# Altium schematic sheet 03. Power.SchDoc
size A4; CheckedBy: 黄钦宁; Author: 陈坤; DocumentNumber: 3; SheetNumber: 3; SheetTotal: 13; PageSetup: Record=PageOptions|CenterHorizontal=True|CenterVertical=True|PrintScale=1.00|XCorrection=1.00|YCorrection=1.00|PrintKind=0|BorderSize=5000000|LeftOffset=0|BottomOffset=0|Orientation=2|PaperLength=1000|PaperWidth=1000|Scale=100|PaperSource=7|PrintQuality=600|MediaType=1|DitherType=10|PaperKind=A4|PrintScaleMode=1; DesignDate: 2013-08-16; CheckDate: 2013-12-28; SheetName: Power; SheetVersion: V1.00; SheetDescription: 评估板电源，包括1路5V，1路3.3V; ProductModel: EasyARM-iMX283; ProductName: EasyARM-iMX28学习套件
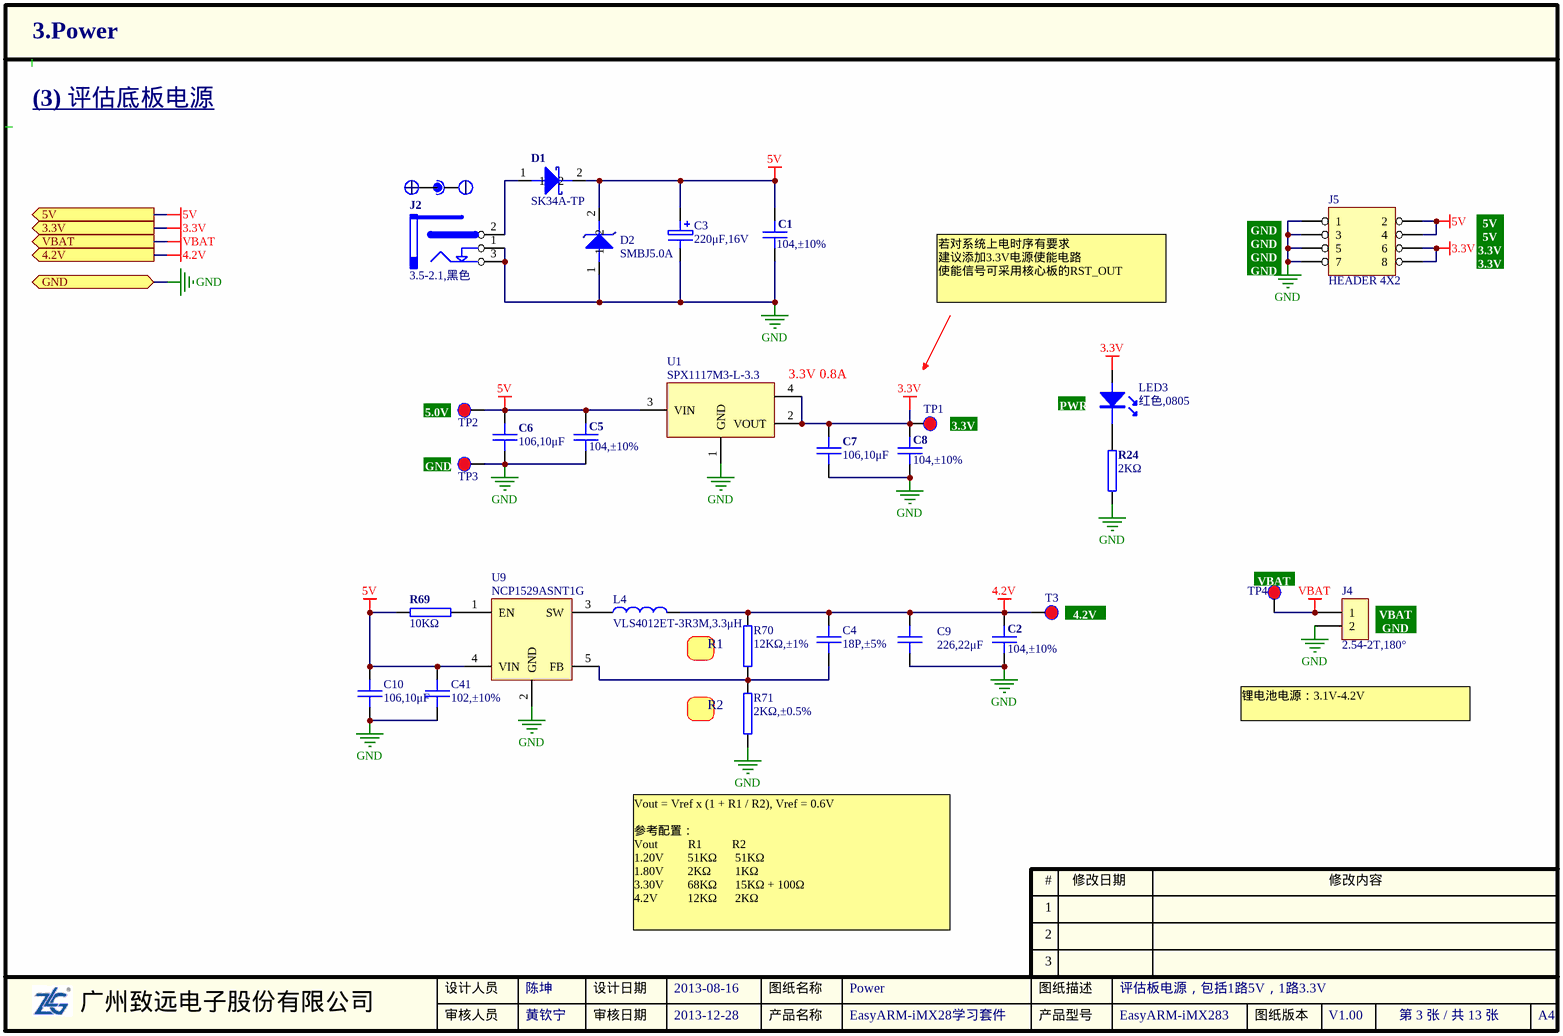
[diagram p0: 03. Power.SchDoc]

## Parts
C1  104,±10%  [0603C]
C2  104,±10%  [0603C]
C3  220μF,16V  [RB-.1/.25]
C4  18P,±5%  [0603C]
C5  104,±10%  [0603C]
C6  106,10μF  [0805C]
C7  106,10μF  [0805C]
C8  104,±10%  [0603C]
C9  226,22μF  [0805C]
C10  106,10μF  [0805C]
C41  102,±10%  [0603C]
D1  value SK34A-TP  [SOD-SK34A]  (hidden comment: DIODE SCHOTTKY)
D2  value SMBJ5.0A  [1812D]  (hidden comment: DIODE ZENER)
J2  value 3.5-2.1,黑色  [POWER-AC]  (hidden comment: POWER-COM)
J4  value 2.54-2T,180°  [CN-2-2.54]  (hidden comment: CON2)
J5  HEADER 4X2  [IDC-8]
L4  value VLS4012ET-3R3M,3.3μH  [L-4.0S-VLS]  (hidden comment: INDUCTOR1)
LED3  value 红色,0805  [LED-0805]  (hidden comment: LED1)
R24  2KΩ  [0603R]
R69  10KΩ  [0603R]
R70  12KΩ,±1%  [0603R]
R71  2KΩ,±0.5%  [0603R]
T3  4.2V  [PAD-40]  (value not drawn)
TP1  3.3V  [PAD-40]  (value not drawn)
TP2  5.0V  [PAD-40]  (value not drawn)
TP3  GND  [PAD-40]  (value not drawn)
TP4  VBAT  [PAD-40]  (value not drawn)
U1  value SPX1117M3-L-3.3  [SOT-223]  (hidden comment: SPX1117M3-L/TR)
U9  value NCP1529ASNT1G  [SOT-23-5]  (hidden comment: SCY99090SNT1G)

## Ports
3.3V, 4.2V (out), 5V (out), GND, VBAT (out)

## Nets
3.3V: C7.1 C8.1 J5.6 J5.8 LED3.1 TP1.1 U1.2(VOUT) U1.4 ; port 3.3V
4.2V: C2.1 C4.1 C9.1 L4.2 R70.2 T3.1 ; port 4.2V
5V: C1.1 C3.1 C5.1 C6.1 C10.1 C41.1 D1.2 D2.2 J5.2 J5.4 R69.1 TP2.1 U1.3(VIN) U9.4(VIN) ; port 5V
GND: C1.2 C2.2 C3.2 C5.2 C6.2 C7.2 C8.2 C9.2 C10.2 C41.2 D2.1 J2.1(A) J2.3(B) J4.2 J5.1 J5.3 J5.5 J5.7 R24.1 R71.1 TP3.1 U1.1(GND) U9.2(GND) ; port GND
VBAT: J4.1 TP4.1 ; port VBAT
NetC4_2: C4.2 R70.1 R71.2 U9.5(FB)
NetD1_1: D1.1 J2.2(B)
NetL4_1: L4.1 U9.3(SW)
NetLED3_2: LED3.2 R24.2
NetR69_2: R69.2 U9.1(EN)

## Notes on the sheet
- (3) 评估底板电源
- (near J5) GND
- 5V
- 3.3V
- 若对系统上电时序有要求
  建议添加3.3V电源使能电路
  使能信号可采用核心板的RST_OUT
- (near U1) 3.3V 0.8A
- (near TP2) 5.0V
- (near LED3) PWR
- (near TP3) GND
- (near TP4) VBAT
- R1
- (near T3) 4.2V
- (near J4) VBAT
- (near J4) GND
- R2
- 锂电池电源：3.1V-4.2V
- Vout = Vref x (1 + R1 / R2), Vref = 0.6V
  参考配置：
  Vout          R1          R2
  1.20V        51KΩ      51KΩ
  1.80V        2KΩ        1KΩ
  3.30V        68KΩ      15KΩ + 100Ω
  4.2V          12KΩ      2KΩ
- 1
- #
- 修改日期
- 修改内容
- 2
- 3
- 广州致远电子股份有限公司
- 设计人员
- 审核人员
- 设计日期
- 审核日期
- 产品名称
- 图纸名称
- 产品型号
- 图纸描述
- 图纸版本
- A4

## Library data of the parts
C1 C2 C5 C8 = 1.02.01.0032: 104,±10%,50V,X7R,0603,*,RoHS; 名称: 电容; 封装: 0603; 设备封装名称: C0603_104_X7R_50V_10%; 贴片和直插: SMT; 器件优选方案: 优先选用; 物料代码: 1.02.01.0032; Value: 104,±10%; RoHS: RoHS; 型号: 104,±10%,50V,X7R; ComponentLink1Description: ErpDataInfo; ComponentLink1URL: http://erp.zlgmcu.com/ErpExt/ErpData/ListMateriel.aspx?pkey=1.02.01.0032
C3 = 1.02.11.0018: 220μF,16V,Ф6.3×7mm,,珠海华冠,RoHS; 名称: 电解电容; 贴片和直插: THT; 物料代码: 1.02.11.0018; Value: 220μF,16V; 厂商: 珠海华冠; RoHS: RoHS; 型号: 220μF,16V,Ф6.3×7mm; ComponentLink1Description: ErpDataInfo; ComponentLink1URL: http://erp.zlgmcu.com/ErpExt/ErpData/ListMateriel.aspx?pkey=1.02.11.0018
C4 = 1.02.01.0003: 18P,±5%,50V,COG,0603,*,RoHS; 名称: 电容; 封装: 0603; 设备封装名称: C0603_18P_COG_50V_5%; 贴片和直插: SMT; 物料代码: 1.02.01.0003; Value: 18P,±5%; RoHS: RoHS; 型号: 18P,±5%,50V,COG; ComponentLink1Description: ErpDataInfo; ComponentLink1URL: http://erp.zlgmcu.com/ErpExt/ErpData/ListMateriel.aspx?pkey=1.02.01.0003
C6 C7 C10 = 1.02.02.0055: 106,10μF,±10%,10V,X5R,0805,RoHS; 名称: 电容; 封装: 0805; 设备封装名称: C0805_106_X5R_10V_10%; 贴片和直插: SMT; 物料代码: 1.02.02.0055; Value: 106,10μF; RoHS: RoHS; 型号: 106,10μF,±10%,10V,X5R; ComponentLink1Description: ErpDataInfo; ComponentLink1URL: http://erp.zlgmcu.com/ErpExt/ErpData/ListMateriel.aspx?pkey=1.02.02.0055
C9 = 1.02.02.0059: 226,22μF,±20%,6.3V,X5R,0805,RoHS; 名称: 电容; 封装: 0805; 设备封装名称: C0805_226_X5R_6.3V_20%; 贴片和直插: SMT; 物料代码: 1.02.02.0059; Value: 226,22μF; RoHS: RoHS; 型号: 226,22μF,±20%,6.3V,X5R; ComponentLink1Description: ErpDataInfo; ComponentLink1URL: http://erp.zlgmcu.com/ErpExt/ErpData/ListMateriel.aspx?pkey=1.02.02.0059
C41 = 1.02.01.0020: 102,±10%,50V,X7R,0603,*,RoHS; 名称: 电容; 封装: 0603; 设备封装名称: C0603_102_X7R_50V_10%; 贴片和直插: SMT; 物料代码: 1.02.01.0020; Value: 102,±10%; RoHS: RoHS; 型号: 102,±10%,50V,X7R; ComponentLink1Description: ErpDataInfo; ComponentLink1URL: http://erp.zlgmcu.com/ErpExt/ErpData/ListMateriel.aspx?pkey=1.02.01.0020
D1 = 1.04.07.0021: SK34A-TP,DO-214AC,MCC,RoHS; 名称: 二极管; 设备封装名称: DO-214AC_SK34A; 贴片和直插: SMT; 物料代码: 1.04.07.0021; 封装: DO-214AC; 厂商: MCC; RoHS: RoHS; 型号: SK34A-TP; ComponentLink1Description: ErpDataInfo; ComponentLink1URL: http://erp.zlgmcu.com/ErpExt/ErpData/ListMateriel.aspx?pkey=1.04.07.0021
D2 = 1.04.03.0001: SMBJ5.0A,DO-214AA,君耀,RoHS; 名称: TVS管; 设备封装名称: DO-214AA_SMBJ5.0A; 贴片和直插: SMT; 器件优选方案: 优先选用; 物料代码: 1.04.03.0001; 封装: DO-214AA; 厂商: 君耀; RoHS: RoHS; 型号: SMBJ5.0A; ComponentLink1Description: ErpDataInfo; ComponentLink1URL: http://erp.zlgmcu.com/ErpExt/ErpData/ListMateriel.aspx?pkey=1.04.03.0001
J2 = 1.10.05.0001: 3.5-2.1,黑色,RoHS; 名称: 电源座; 贴片和直插: THT; 物料代码: 1.10.05.0001; RoHS: RoHS; 型号: 3.5-2.1,黑色; ComponentLink1Description: ErpDataInfo; ComponentLink1URL: http://erp.zlgmcu.com/ErpExt/ErpData/ListMateriel.aspx?pkey=1.10.05.0001
J4 = 1.10.06.0009: 2.54-2T,180°,,*; 名称: 插座; 贴片和直插: THT; 物料代码: 1.10.06.0009; 型号: 2.54-2T,180°; ComponentLink1Description: ErpDataInfo; ComponentLink1URL: http://erp.zlgmcu.com/ErpExt/ErpData/ListMateriel.aspx?pkey=1.10.06.0009
L4 = 1.03.01.0155: VLS4012ET-3R3M,3.3μH,1.4A,SMD,TDK,RoHS; 名称: 电感; 贴片和直插: SMT; 物料代码: 1.03.01.0155; 封装: SMD; 厂商: TDK; RoHS: RoHS; 型号: VLS4012ET-3R3M,3.3μH,1.4A; ComponentLink1Description: ErpDataInfo; ComponentLink1URL: http://erp.zlgmcu.com/ErpExt/ErpData/ListMateriel.aspx?pkey=1.03.01.0155
LED3 = 1.04.05.0001: 红色,0805,0805,RoHS; 名称: 发光二极管; 封装: 0805; 设备封装名称: LED0805-RED; 贴片和直插: SMT; 器件优选方案: 优先选用; 物料代码: 1.04.05.0001; RoHS: RoHS; 型号: 红色,0805; ComponentLink1Description: ErpDataInfo; ComponentLink1URL: http://erp.zlgmcu.com/ErpExt/ErpData/ListMateriel.aspx?pkey=1.04.05.0001
R24 = 1.01.01.0038: 2KΩ,0603,*,RoHS; 名称: 电阻; 封装: 0603; 设备封装名称: R0603_2K; 贴片和直插: SMT; 物料代码: 1.01.01.0038; Value: 2KΩ; RoHS: RoHS; 型号: 2KΩ; ComponentLink1Description: ErpDataInfo; ComponentLink1URL: http://erp.zlgmcu.com/ErpExt/ErpData/ListMateriel.aspx?pkey=1.01.01.0038
R69 = 1.01.01.0051: 10KΩ,0603,*,RoHS; 名称: 电阻; 封装: 0603; 设备封装名称: R0603_10K; 贴片和直插: SMT; 物料代码: 1.01.01.0051; Value: 10KΩ; RoHS: RoHS; 型号: 10KΩ; ComponentLink1Description: ErpDataInfo; ComponentLink1URL: http://erp.zlgmcu.com/ErpExt/ErpData/ListMateriel.aspx?pkey=1.01.01.0051
R70 = 1.01.01.0053: 12KΩ,±1%,0603,*,RoHS; 名称: 电阻; 封装: 0603; 设备封装名称: R0603_12K_1%; 贴片和直插: SMT; 物料代码: 1.01.01.0053; Value: 12KΩ,±1%; RoHS: RoHS; 型号: 12KΩ,±1%; ComponentLink1Description: ErpDataInfo; ComponentLink1URL: http://erp.zlgmcu.com/ErpExt/ErpData/ListMateriel.aspx?pkey=1.01.01.0053
R71 = 1.01.01.0084: 2KΩ,±0.5%,0603,*,RoHS; 名称: 电阻; 封装: 0603; 设备封装名称: R0603_2K_0.5%; 贴片和直插: SMT; 物料代码: 1.01.01.0084; Value: 2KΩ,±0.5%; RoHS: RoHS; 型号: 2KΩ,±0.5%; ComponentLink1Description: ErpDataInfo; ComponentLink1URL: http://erp.zlgmcu.com/ErpExt/ErpData/ListMateriel.aspx?pkey=1.01.01.0084
T3 TP1-TP4 = TEST-DOT
U1 = 1.05.09.0025: SPX1117M3-L-3.3,SOT-223,EXAR,RoHS; 名称: IC; 设备封装名称: SOT-223_SPX1117M3-L-3.3; 贴片和直插: SMT; 物料代码: 1.05.09.0025; 封装: SOT-223; 厂商: EXAR; RoHS: RoHS; 型号: SPX1117M3-L-3.3; ComponentLink1Description: ErpDataInfo; ComponentLink1URL: http://erp.zlgmcu.com/ErpExt/ErpData/ListMateriel.aspx?pkey=1.05.09.0025
U9 = 1.05.09.0091: NCP1529ASNT1G,TSOP-5,ON,RoHS; 名称: IC; 设备封装名称: TSOP-5_NCP1529ASNT1G; 贴片和直插: SMT; 物料代码: 1.05.09.0091; 封装: TSOP-5; 厂商: ON; RoHS: RoHS; 型号: NCP1529ASNT1G; ComponentLink1Description: ErpDataInfo; ComponentLink1URL: http://erp.zlgmcu.com/ErpExt/ErpData/ListMateriel.aspx?pkey=1.05.09.0091